# Altium schematic sheet BMS.SchDoc
size A4
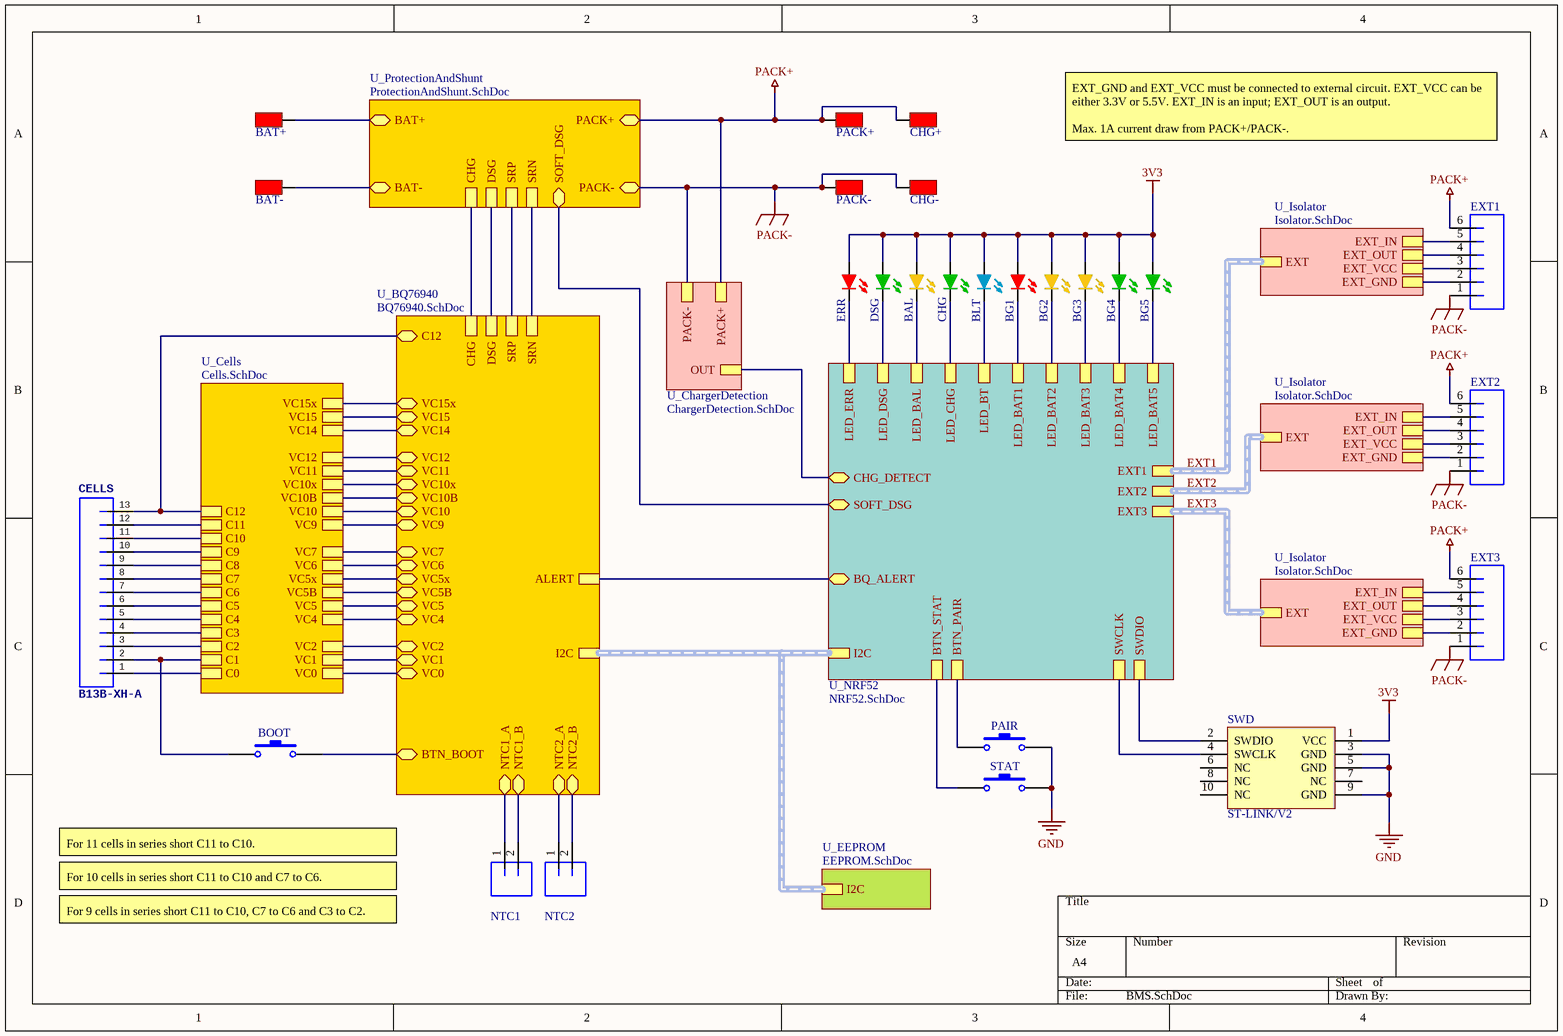
[diagram p0: BMS.SchDoc]

## Parts
BAL  LED  [LED0603]  (value not drawn)
BAT+  WIRE_LARGE  [WIRE_LARGE]  (value not drawn)
BAT-  WIRE_LARGE  [WIRE_LARGE]  (value not drawn)
BG1  LED  [LED0603]  (value not drawn)
BG2  LED  [LED0603]  (value not drawn)
BG3  LED  [LED0603]  (value not drawn)
BG4  LED  [LED0603]  (value not drawn)
BG5  LED  [LED0603]  (value not drawn)
BLT  LED  [LED0603]  (value not drawn)
BOOT  Button  [BUTTON]  (value not drawn)
CELLS  B13B-XH-A  [JST-13-PTH-VERT]
CHG  LED  [LED0603]  (value not drawn)
CHG+  WIRE_MEDIUM  [WIRE_MEDIUM]  (value not drawn)
CHG-  WIRE_MEDIUM  [WIRE_MEDIUM]  (value not drawn)
DSG  LED  [LED0603]  (value not drawn)
ERR  LED  [LED0603]  (value not drawn)
EXT1  EXT  [JST B6B-PH-K]  (value not drawn)
EXT2  EXT  [JST B6B-PH-K]  (value not drawn)
EXT3  EXT  [JST B6B-PH-K]  (value not drawn)
NTC1  TEMP  [JST-2-PTH-VERT]  (value not drawn)
NTC2  TEMP  [JST-2-PTH-VERT]  (value not drawn)
PACK+  WIRE_LARGE  [WIRE_LARGE]  (value not drawn)
PACK-  WIRE_LARGE  [WIRE_LARGE]  (value not drawn)
PAIR  Button  [BUTTON]  (value not drawn)
STAT  Button  [BUTTON]  (value not drawn)
SWD  ST-LINK/V2  [SWD]

## Sub-sheets
U_BQ76940 = BQ76940.SchDoc: ALERT, I2C (harness I2C), CHG, DSG, SRP, SRN, C12, VC10, VC7, VC5x, VC5B, VC1, VC2, VC15x, VC9, VC10x, VC5, VC12, VC6, VC10B, VC14, VC11, VC4, VC15, VC0, BTN_BOOT, NTC2_B, NTC1_A, NTC2_A, NTC1_B
U_Cells = Cells.SchDoc: VC15x, VC10x, VC5x, VC10, VC5, VC0, VC1, VC2, VC4, VC5B, VC6, VC7, VC9, VC10B, VC11, VC12, VC14, VC15, C11, C10, C9, C8, C7, C6, C5, C4, C3, C2, C1, C0, C12
U_ChargerDetection = ChargerDetection.SchDoc: PACK-, PACK+, OUT
U_EEPROM = EEPROM.SchDoc: I2C (harness I2C)
U_Isolator = Isolator.SchDoc: EXT (harness EXT), EXT_IN, EXT_OUT, EXT_VCC, EXT_GND
U_Isolator = Isolator.SchDoc: EXT (harness EXT), EXT_IN, EXT_OUT, EXT_VCC, EXT_GND
U_Isolator = Isolator.SchDoc: EXT (harness EXT), EXT_IN, EXT_OUT, EXT_VCC, EXT_GND
U_NRF52 = NRF52.SchDoc: SWDIO, SWCLK, BTN_PAIR, BTN_STAT, LED_BAT1, LED_BAT2, LED_BAT3, LED_BAT4, LED_BAT5, LED_CHG, LED_DSG, LED_BAL, LED_BT, LED_ERR, EXT3 (harness EXT), EXT2 (harness EXT), EXT1 (harness EXT), I2C (harness I2C), BQ_ALERT, CHG_DETECT, SOFT_DSG
U_ProtectionAndShunt = ProtectionAndShunt.SchDoc: SRP, SRN, CHG, DSG, BAT+, PACK+, PACK-, BAT-, SOFT_DSG

## Nets
3V3: BAL.A BG1.A BG2.A BG3.A BG4.A BG5.A BLT.A CHG.A DSG.A ERR.A SWD.1(VCC)
GND: PAIR.2 STAT.2 SWD.3(GND) SWD.5(GND) SWD.9(GND)
PACK+: CHG+.1 EXT1.6 EXT2.6 EXT3.6 PACK+.1 ; sheet U_ProtectionAndShunt/PACK+, sheet U_ChargerDetection/PACK+
PACK-: CHG-.1 EXT1.1 EXT2.1 EXT3.1 PACK-.1 ; sheet U_ProtectionAndShunt/PACK-, sheet U_ChargerDetection/PACK-
NetBAL_C: BAL.C ; sheet U_NRF52/LED_BAL
NetBAT+_1: BAT+.1 ; sheet U_ProtectionAndShunt/BAT+
NetBAT-_1: BAT-.1 ; sheet U_ProtectionAndShunt/BAT-
NetBG1_C: BG1.C ; sheet U_NRF52/LED_BAT1
NetBG2_C: BG2.C ; sheet U_NRF52/LED_BAT2
NetBG3_C: BG3.C ; sheet U_NRF52/LED_BAT3
NetBG4_C: BG4.C ; sheet U_NRF52/LED_BAT4
NetBG5_C: BG5.C ; sheet U_NRF52/LED_BAT5
NetBLT_C: BLT.C ; sheet U_NRF52/LED_BT
NetBOOT_1: BOOT.1 CELLS.2 ; sheet U_Cells/C1
NetBOOT_2: BOOT.2 ; sheet U_BQ76940/BTN_BOOT
NetCELLS_1: CELLS.1 ; sheet U_Cells/C0
NetCELLS_3: CELLS.3 ; sheet U_Cells/C2
NetCELLS_4: CELLS.4 ; sheet U_Cells/C3
NetCELLS_5: CELLS.5 ; sheet U_Cells/C4
NetCELLS_6: CELLS.6 ; sheet U_Cells/C5
NetCELLS_7: CELLS.7 ; sheet U_Cells/C6
NetCELLS_8: CELLS.8 ; sheet U_Cells/C7
NetCELLS_9: CELLS.9 ; sheet U_Cells/C8
NetCELLS_10: CELLS.10 ; sheet U_Cells/C9
NetCELLS_11: CELLS.11 ; sheet U_Cells/C10
NetCELLS_12: CELLS.12 ; sheet U_Cells/C11
NetCELLS_13: CELLS.13 ; sheet U_BQ76940/C12, sheet U_Cells/C12
NetCHG_C: CHG.C ; sheet U_NRF52/LED_CHG
NetDSG_C: DSG.C ; sheet U_NRF52/LED_DSG
NetERR_C: ERR.C ; sheet U_NRF52/LED_ERR
NetEXT1_2: EXT1.2 ; sheet U_Isolator/EXT_GND
NetEXT1_3: EXT1.3 ; sheet U_Isolator/EXT_VCC
NetEXT1_4: EXT1.4 ; sheet U_Isolator/EXT_OUT
NetEXT1_5: EXT1.5 ; sheet U_Isolator/EXT_IN
NetEXT2_2: EXT2.2 ; sheet U_Isolator/EXT_GND
NetEXT2_3: EXT2.3 ; sheet U_Isolator/EXT_VCC
NetEXT2_4: EXT2.4 ; sheet U_Isolator/EXT_OUT
NetEXT2_5: EXT2.5 ; sheet U_Isolator/EXT_IN
NetEXT3_2: EXT3.2 ; sheet U_Isolator/EXT_GND
NetEXT3_3: EXT3.3 ; sheet U_Isolator/EXT_VCC
NetEXT3_4: EXT3.4 ; sheet U_Isolator/EXT_OUT
NetEXT3_5: EXT3.5 ; sheet U_Isolator/EXT_IN
NetNTC1_1: NTC1.1 ; sheet U_BQ76940/NTC1_A
NetNTC1_2: NTC1.2 ; sheet U_BQ76940/NTC1_B
NetNTC2_1: NTC2.1 ; sheet U_BQ76940/NTC2_A
NetNTC2_2: NTC2.2 ; sheet U_BQ76940/NTC2_B
NetPAIR_1: PAIR.1 ; sheet U_NRF52/BTN_PAIR
NetSTAT_1: STAT.1 ; sheet U_NRF52/BTN_STAT
NetSWD_2: SWD.2(SWDIO) ; sheet U_NRF52/SWDIO
NetSWD_4: SWD.4(SWCLK) ; sheet U_NRF52/SWCLK
(unnamed): sheet U_BQ76940/ALERT, sheet U_NRF52/BQ_ALERT
(unnamed): sheet U_BQ76940/CHG, sheet U_ProtectionAndShunt/CHG
(unnamed): sheet U_BQ76940/DSG, sheet U_ProtectionAndShunt/DSG
(unnamed): sheet U_BQ76940/SRP, sheet U_ProtectionAndShunt/SRP
(unnamed): sheet U_BQ76940/SRN, sheet U_ProtectionAndShunt/SRN
(unnamed): sheet U_BQ76940/VC10, sheet U_Cells/VC10
(unnamed): sheet U_BQ76940/VC7, sheet U_Cells/VC7
(unnamed): sheet U_BQ76940/VC5x, sheet U_Cells/VC5x
(unnamed): sheet U_BQ76940/VC5B, sheet U_Cells/VC5B
(unnamed): sheet U_BQ76940/VC1, sheet U_Cells/VC1
(unnamed): sheet U_BQ76940/VC2, sheet U_Cells/VC2
(unnamed): sheet U_BQ76940/VC15x, sheet U_Cells/VC15x
(unnamed): sheet U_BQ76940/VC9, sheet U_Cells/VC9
(unnamed): sheet U_BQ76940/VC10x, sheet U_Cells/VC10x
(unnamed): sheet U_BQ76940/VC5, sheet U_Cells/VC5
(unnamed): sheet U_BQ76940/VC12, sheet U_Cells/VC12
(unnamed): sheet U_BQ76940/VC6, sheet U_Cells/VC6
(unnamed): sheet U_BQ76940/VC10B, sheet U_Cells/VC10B
(unnamed): sheet U_BQ76940/VC14, sheet U_Cells/VC14
(unnamed): sheet U_BQ76940/VC11, sheet U_Cells/VC11
(unnamed): sheet U_BQ76940/VC4, sheet U_Cells/VC4
(unnamed): sheet U_BQ76940/VC15, sheet U_Cells/VC15
(unnamed): sheet U_BQ76940/VC0, sheet U_Cells/VC0
(unnamed): sheet U_ProtectionAndShunt/SOFT_DSG, sheet U_NRF52/SOFT_DSG
(unnamed): sheet U_NRF52/CHG_DETECT, sheet U_ChargerDetection/OUT

Not connected (* = marked no-connect by the designer): SWD 6(NC) 7(NC) 8(NC) 10(NC)

## Buses and harness runs
harness EXT1 = sheet U_Isolator/EXT = sheet U_NRF52/EXT1
harness EXT2 = sheet U_Isolator/EXT = sheet U_NRF52/EXT2
harness EXT3 = sheet U_Isolator/EXT = sheet U_NRF52/EXT3
harness sheet U_BQ76940/I2C = sheet U_EEPROM/I2C = sheet U_NRF52/I2C

## Notes on the sheet
- EXT_GND and EXT_VCC must be connected to external circuit. EXT_VCC can be either 3.3V or 5.5V. EXT_IN is an input; EXT_OUT is an output.
  Max. 1A current draw from PACK+/PACK-.
- For 11 cells in series short C11 to C10.
- For 10 cells in series short C11 to C10 and C7 to C6.
- For 9 cells in series short C11 to C10, C7 to C6 and C3 to C2.

## Library data of the parts
BAL BG2 BG3 = LED_YELLOW: PartNumber: LTST-C193TGKT-5A; Manufacturer: Lite-On Inc.; PackageReference: 0603; PackageDescription: 0603 (1608 Metric); Mounting Technology: Surface Mount
BG1 ERR = LED_RED: PartNumber: LTST-C193TGKT-5A; Manufacturer: Lite-On Inc.; PackageReference: 0603; PackageDescription: 0603 (1608 Metric); Mounting Technology: Surface Mount
BG4 BG5 CHG DSG = LED_GREEN: PartNumber: LTST-C193TGKT-5A; Manufacturer: Lite-On Inc.; PackageReference: 0603; PackageDescription: 0603 (1608 Metric); Mounting Technology: Surface Mount
BLT = LED_BLUE: PartNumber: LTST-C193TGKT-5A; Manufacturer: Lite-On Inc.; PackageReference: 0603; PackageDescription: 0603 (1608 Metric); Mounting Technology: Surface Mount
BOOT PAIR STAT = BUTTON: Push Button; pin to pad: 2>3; Published: 24-Mar-1999; LatestRevisionDate: 17-Jul-2002; LatestRevisionNote: Re-released for DXP Platform.; PackageReference: SPST-2; Publisher: Altium Limited; PackageDescription: Switch; 2 Leads
CELLS = JST_XH_13
EXT1-EXT3 = JST_PH_6_VERT: Manufacturer: JST Sales America, Inc.; Mounting Technology: Through Hole; PackageReference: JST-PH
NTC1 NTC2 = JST_PH_2_VERT: Manufacturer: JST Sales America, Inc.; PartNumber: B2B-PH-K-S(LF)(SN); Mounting Technology: Through Hole; PackageReference: JST-PH
SWD = SWD Connector